# Altium project zulu_a7_hdi_optimized.PrjPcb (part 2 of 2)

## Sheet zulu_a7_4.SchDoc
size 240 x 314 mm; Author: Christian Tambe; VERSION#: 1.0; Origin: Eagle; OriginPath: C:\Users\tambe\Documents\Electronics\Zulu_A7\Zulu_Altrium\zulu_a7.sch; OriginSheet: 5; OriginDescription: FT2232HL, JTAG, CLOCK
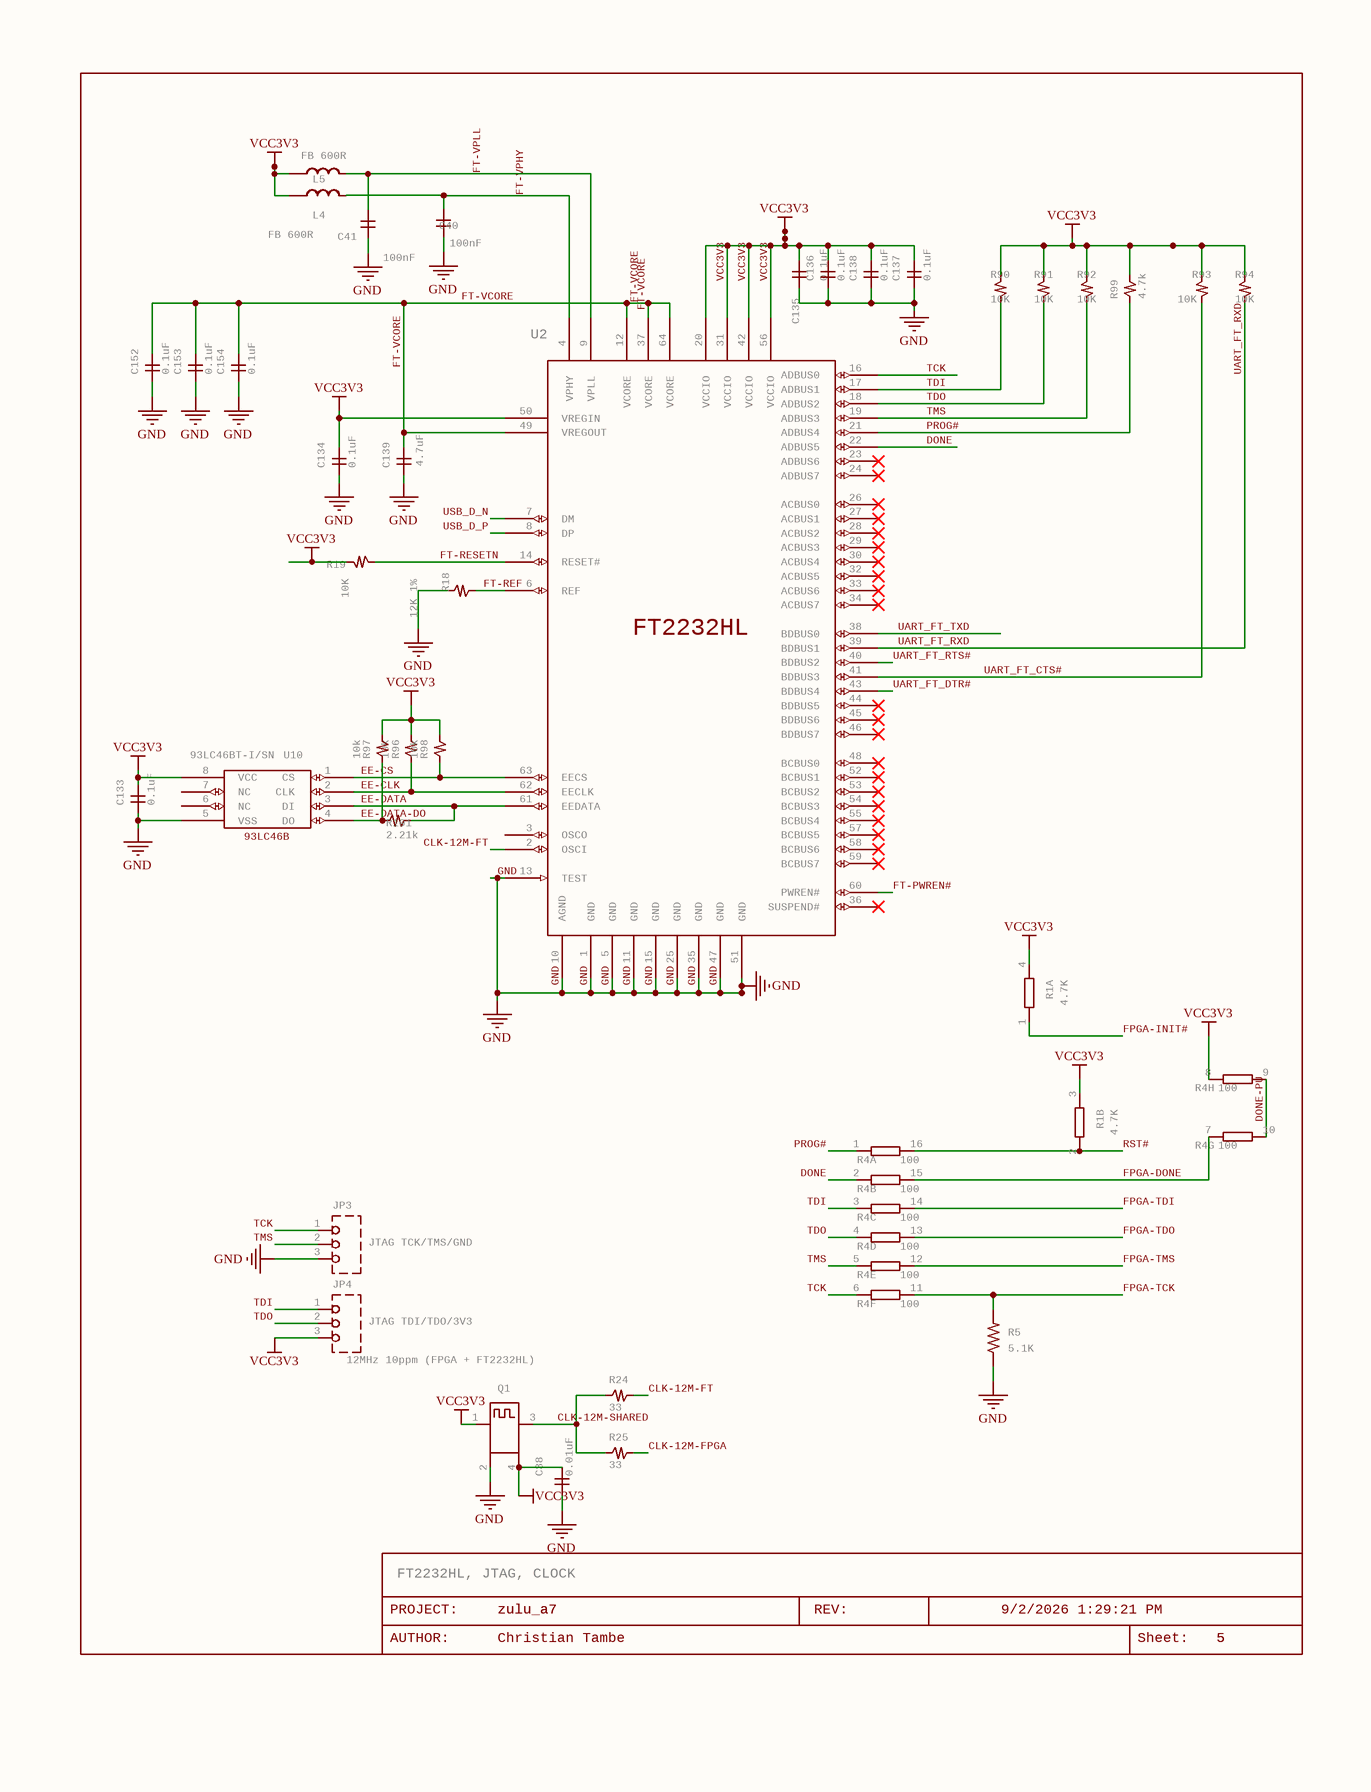
[diagram p4: zulu_a7_4.SchDoc]

### Parts
C38  0.01uF  [C0201]
C40  100nF  [C0201]
C41  100nF  [C0201]
C133  0.1uF  [C0201]
C134  0.1uF  [C0201]
C135  0.1uF  [C0201]
C136  0.1uF  [C0201]
C137  0.1uF  [C0201]
C138  0.1uF  [C0201]
C139  4.7uF  [C0402]
C152  0.1uF  [C0201]
C153  0.1uF  [C0201]
C154  0.1uF  [C0201]
FRAME4  LAST_DATE_TIME: 9/2/2026 1:29:21 PM  Sheet: Sheet:  SHEET: 5  REV: REV:  PROJECT: PROJECT:  DRAWING_NAME: zulu_a7  AUTHOR: Christian Tambe  (hidden comment: DOCFIELD)  (graphical)
JP3  JTAG TCK/TMS/GND  [1X03-NOSILK]
JP4  JTAG TDI/TDO/3V3  [1X03-NOSILK]
L4  FB 600R  [IND0603]
L5  FB 600R  [IND0603]
Q1  12MHz 10ppm (FPGA + FT2232HL)  [32X25]
R1  4.7K  [742C043]  (parts A,B of 2)
R4  100  [742C163]  (parts A,B,C,D,E,F,G,H of 8)
R5  5.1K  [R0201]
R18  12K 1%  [R0402]
R19  10K  [R0201]
R24  33  [R0201]
R25  33  [R0201]
R90  10K  [R0201]
R91  10K  [R0201]
R92  10K  [R0201]
R93  10K  [R0201]
R94  10K  [R0201]
R96  10k  [R0201]
R97  10k  [R0201]
R98  10k  [R0201]
R99  4.7k  [R0201]
R101  2.21k  [R0201]
U2  FT2232HL USB-UART/JTAG Bridge  [FT2232HL-LQFP64]  (value not drawn)
U10  93LC46BT-I/SN  [SPI-8_SOIC_150]

### Nets
GND: C38.1 C40.1 C41.1 C133.1 C134.1 C135.1 C136.1 C137.1 C138.1 C139.1 C152.1 C153.1 C154.1 JP3.3 Q1.2 R5.1 R18.1 U2.1(GND) U2.5(GND) U2.10(AGND) U2.11(GND) U2.13(TEST) U2.15(GND) U2.25(GND) U2.35(GND) U2.47(GND) U2.51(GND) U10.5(VSS)
VCC3V3: C38.2 C133.2 C134.2 C135.2 C136.2 C137.2 C138.2 JP4.3 L4.2 L5.2 Q1.1 Q1.4 R1.3 R1.4 R4.8 R19.2 R90.2 R91.2 R92.2 R93.2 R94.2 R96.2 R97.2 R98.2 R99.2 U2.20(VCCIO) U2.31(VCCIO) U2.42(VCCIO) U2.50(VREGIN) U2.56(VCCIO) U10.8(VCC)
CLK-12M-FPGA: R25.2
CLK-12M-FT: R24.2 U2.2(OSCI)
CLK-12M-SHARED: Q1.3 R24.1 R25.1
DONE: R4.2 U2.22(ADBUS5)
DONE-PU: R4.9 R4.10
EE-CLK: R96.1 U2.62(EECLK) U10.2(CLK)
EE-CS: R98.1 U2.63(EECS) U10.1(CS)
EE-DATA: R101.2 U2.61(EEDATA) U10.3(DI)
EE-DATA-DO: R97.1 R101.1 U10.4(DO)
FPGA-DONE: R4.7 R4.15
FPGA-INIT#: R1.1
FPGA-TCK: R4.11 R5.2
FPGA-TDI: R4.14
FPGA-TDO: R4.13
FPGA-TMS: R4.12
FT-PWREN#: U2.60(PWREN#)
FT-REF: R18.2 U2.6(REF)
FT-RESETN: R19.1 U2.14(RESET#)
FT-VCORE: C139.2 C152.2 C153.2 C154.2 U2.12(VCORE) U2.37(VCORE) U2.49(VREGOUT) U2.64(VCORE)
FT-VPHY: C40.2 L4.1 U2.4(VPHY)
FT-VPLL: C41.2 L5.1 U2.9(VPLL)
PROG#: R4.1 R99.1 U2.21(ADBUS4)
RST#: R1.2 R4.16
TCK: JP3.1 R4.6 U2.16(ADBUS0)
TDI: JP4.1 R4.3 R90.1 U2.17(ADBUS1)
TDO: JP4.2 R4.4 R91.1 U2.18(ADBUS2)
TMS: JP3.2 R4.5 R92.1 U2.19(ADBUS3)
UART_FT_CTS#: R93.1 U2.41(BDBUS3)
UART_FT_DTR#: U2.43(BDBUS4)
UART_FT_RTS#: U2.40(BDBUS2)
UART_FT_RXD: R94.1 U2.39(BDBUS1)
UART_FT_TXD: U2.38(BDBUS0)
USB_D_N: U2.7(DM)
USB_D_P: U2.8(DP)

Not connected (* = marked no-connect by the designer): U2 3(OSCO) 23(ADBUS6)* 24(ADBUS7)* 26(ACBUS0)* 27(ACBUS1)* 28(ACBUS2)* 29(ACBUS3)* 30(ACBUS4)* 32(ACBUS5)* 33(ACBUS6)* 34(ACBUS7)* 36(SUSPEND#)* 44(BDBUS5)* 45(BDBUS6)* 46(BDBUS7)* 48(BCBUS0)* 52(BCBUS1)* 53(BCBUS2)* 54(BCBUS3)* 55(BCBUS4)* 57(BCBUS5)* 58(BCBUS6)* 59(BCBUS7)*; U10 6(NC) 7(NC)

### Notes on the sheet
- (near FRAME4) FT2232HL, JTAG, CLOCK
- (near FRAME4) AUTHOR:

### Library data of the parts
C38 = C-GENERICC0201: CAPACITOR, generic non-polarized, horizontal pins; GateName_1: G$1; SymbolName_1: C-GENERIC-H; MANF: Murata; MANF#: GRM033R71E103KE14D; NOTE: 0402 -> 0201 on U2's support. 50V drops to 25V, which is still far over what a 3.3V rail needs -- the 50V part was over-specified. Confirm the MPN suffix before ordering.; SPEC: X7R 25V +-10%, 0.30 mm max; DeviceName: C0201; LibraryName: rcl; DeviceSetName: C-GENERIC
C40 C41 C133-C138 = C-GENERICC0201: CAPACITOR, generic non-polarized, horizontal pins; GateName_1: G$1; SymbolName_1: C-GENERIC-H; MANF: Murata; MANF#: GRM033R61A104KE15D; NOTE: 0402 -> 0201 on U2's support. The DIELECTRIC AND VOLTAGE BOTH CHANGE: X7R 16V becomes X5R 10V, because 0201 at this capacitance is an X5R part. X5R narrows the temperature range to -55..+85 C from X7R's +125, which suits this board but is not a like-for-like swap. At 0.1 uF the DC bias derating is mild, unlike the 0.47 uF on sheet 7. Confirm the MPN suffix against Murata's data before ordering.; SPEC: X5R 10V +-10%, 0.30 mm max; DeviceName: C0201; LibraryName: rcl; DeviceSetName: C-GENERIC
C139 = C-GENERICC0402: CAPACITOR, generic non-polarized, horizontal pins; GateName_1: G$1; SymbolName_1: C-GENERIC-H; MANF: Taiyo Yuden; MANF#: MSASJ105BB5475MFNA01; SPEC: X5R 6.3V +-20% 0402 4.7uF, 0.65 mm max, about 3.7 uF left at 1.8 V; Digi-Key alias JMK105BBJ475MV-F (587-2787-1-ND, 1.6 M pcs); replaced the unobtainable 3.3 uF GRM155R60J335ME15D on the FT2232H VCORE node (FTDI minimum 3.3 uF) on 2026-09-08; DeviceName: C0402; LibraryName: rcl; DeviceSetName: C-GENERIC
C152-C154 = C-GENERICC0201: CAPACITOR, generic non-polarized, horizontal pins; GateName_1: G$1; SymbolName_1: C-GENERIC-H; MANF: Murata; MANF#: GRM033R61A104KE15D; NOTE: FT2232H core-rail decoupling. DS_FT2232H Figures 4.1 and 6.1 show a 100 nF at each VCORE pin besides the 4.7 uF bulk (C39, C139); the board had the bulk and none of these. Same part as the eight 0.1 uF and 100 nF 0201 capacitors already on this sheet, so no new BOM line. AT LAYOUT: put one beside each of pins 12, 37 and 64 with the shortest ground return you can manage -- that placement is the whole point of them.; SPEC: X5R 10V +-10% 0201 0.1uF, 0.30 mm max -- one per FT2232H VCORE pin, added 2026-09-09 after docs/connectivity_check.md found the core rail carrying bulk only; DeviceName: C0201; LibraryName: rcl; DeviceSetName: C-GENERIC
FRAME4 = DOCFIELD: DOCUMENT FIELD; GateName_1: G$1; SymbolName_1: DOCFIELD; LibraryName: ctambe; DeviceSetName: DOCFIELD
JP3 = TESTPT-1X3NOSILK: Three plated holes, 1x3 on 2.54 mm   NOT a fitted header, which is why it is no longer called one. The footprint is an ordinary 1x3 header pattern and a strip could be soldered in for bring-up, but nothing is populated: a 1x3 body clears the Pmod shroud beside it by 0.09 mm, inside anyone's assembly tolerance. Drawn dashed with open holes so the sheet stops reading as a connector, the way the 2x3 it replaced did.; SymbolName_1: TP1X3; DeviceName: NOSILK; NOTE: Bare plated holes -- NO HEADER FITTED, nothing to order. Three of the six JTAG holes; JP4 carries the other three, 17.96 mm away on the far side of the Pmod. Each row has 3.05 mm of board to the Pmod but only 0.09 mm to a 1x3 strip's body, so these are for flying leads or a pogo jig. The FT2232 does JTAG over USB on channel B; this is the fallback.; DNS: Yes; SPEC: DNS - do not stuff: three bare plated holes, 1x3 on 2.54 mm, for flying leads or pogo pins; no part to order (flagged 2026-09-08); GateName_1: A; LibraryName: pinhead; DeviceSetName: TESTPT-1X3
JP4 = TESTPT-1X3NOSILK: Three plated holes, 1x3 on 2.54 mm   NOT a fitted header, which is why it is no longer called one. The footprint is an ordinary 1x3 header pattern and a strip could be soldered in for bring-up, but nothing is populated: a 1x3 body clears the Pmod shroud beside it by 0.09 mm, inside anyone's assembly tolerance. Drawn dashed with open holes so the sheet stops reading as a connector, the way the 2x3 it replaced did.; SymbolName_1: TP1X3; DeviceName: NOSILK; NOTE: Bare plated holes -- NO HEADER FITTED, nothing to order. Three of the six JTAG holes; JP3 carries the other three, 17.96 mm away on the far side of the Pmod. Each row has 3.05 mm of board to the Pmod but only 0.09 mm to a 1x3 strip's body, so these are for flying leads or a pogo jig. The FT2232 does JTAG over USB on channel B; this is the fallback.; DNS: Yes; SPEC: DNS - do not stuff: three bare plated holes, 1x3 on 2.54 mm, for flying leads or pogo pins; no part to order (flagged 2026-09-08); GateName_1: A; LibraryName: pinhead; DeviceSetName: TESTPT-1X3
L4 L5 = INDUCTOR: INDUCTOR, generic power inductor; GateName_1: G$1; MANF: Murata; MANF#: BLM18KG601SN1D; SPEC: ferrite bead 600 ohm at 100 MHz +-25%, 1.3 A at 85 C, 0.15 ohm max, 0603, 0.90 mm max; replaced BLM18PG601SN1D (a number Murata never made; the spec 600 ohm/1.5 A is BLM18SP601SN1D) on 2026-09-08; L4/L5 feed the FT2232H VPHY/VPLL (60 mA max), L6 GNDADC, L7 VCCADC (25 mA); SymbolName_1: INDUCTOR; LibraryName: ctambe; DeviceSetName: INDUCTOR
Q1 = OSC_CHIPASEM1-12MHZ: Crystal Chip; GateName_1: G$1; DeviceName: ECS-3225SMV; MANF: ECS; MANF#: ECS-3225SMV-120-FP-TR; NOTE: ACTIVE OSCILLATOR, NOT A CRYSTAL -- the schematic settles it: pin 2 to GND, pin 4 to VCC3V3, pin 3 out into R24 and R25, and pin 1 tied to VCC3V3, which is a 4-pad XO with its enable held high. A crystal would have two pads and load capacitors. THE FREQUENCY IS NOT A CHOICE: the FT2232H wants 12 MHz for its USB PLL, so that was fixed before anything else. 25 ppm is the value already recorded and is comfortably inside what FTDI asks of the reference. Output drives two loads through 33R each, the FT2232's OSCI and the FPGA clock ball. Pin 1 to Vdd suits either an OE part or one with pin 1 not connected, so the choice is not narrowed by it. ASEM1 is the family the design note already named. Confirm the suffix -- it encodes stability and temperature range and is the easy thing to get wrong.; SPEC: 12.000 MHz HCMOS XO, 1.62-3.63 V, +-10 ppm incl. initial, temp -40..105 C, supply, load, reflow and aging (ECS-3225SMV sheet p1), 3.2x2.5x1.2 mm, pin 1 tri-state (H/NC = run), 6 mA typ / 10 mA max; replaced the +-50 ppm ASEM1-12.000MHZ-LC-T on 2026-09-08; SymbolName_1: OSC_CHIP; LibraryName: ctambe; DeviceSetName: OSC_CHIP
R1 = RES2742: Resistor 2-pack   Package of two resistors.; GateName_1: A; SymbolName_1: R1NV0; GateName_2: B; DeviceName: 742; DeviceSetName: RES2; MANF: CTS; MANF#: 742C043472JP; SPEC: 2 x 4.7K +-5% isolated array, 0606 concave 1.60 x 1.60 mm, 0.80 mm pitch, 63 mW per element; NOTE: The two configuration pull-ups in one package: A on INIT_B (net FPGA-INIT#), B on PROGRAM_B (net RST#). Both commons are pads 3 and 4, side by side on one long side of the body, and both go to VCC3V3. CTS publishes ONE recommended land pattern for the whole 742 package family, so this footprint is the 742C083 pad cell already validated for R34 with two pads per side instead of four. 5 percent: the 742C043 has no 1 percent option either, and a configuration pull-up does not care; 63 mW per element against the 2.3 mW that 3.3 V across 4.7 k actually dissipates. Alternate on the identical land: Panasonic EXB-V4V472JV, same 1.60 x 1.60 mm concave body on 0.80 mm pitch. Do NOT substitute EXB-34V472JV -- same size, convex terminals, different land. R99, the third 4.7 k pull-up on this sheet, stays discrete: it sits on PROG#, the far side of the 100 ohm now in R4. TOLERANCE AGAINST UG470: Table 2-4 asks for a pull-up of 4.7 kohm OR LESS on both of these pins, and this is a 5 percent part, so its worst case is 4.935 k -- 5 percent outside the stated maximum. That is a wording problem rather than a physical one. The limit exists to hold the pin high against input leakage, and DS181 worst-case leakage of 15 uA across 4.935 k is 74 mV, against a VIH of 2.0 V. The discretes this replaces were 1 percent parts and were already outside the same limit, at 4.747 k. Strict compliance would mean 4.3 kohm +-5 percent (4.515 k worst case), but CTS does not stock a 432 code in the 742C043 family -- the stocked spread is 101, 220, 470, 471, 472, 473, 102, 103 and 104 -- so buying compliance here would cost availability, which is the thing that actually stops a board getting built. Dropping to the next stocked value, 1 k, would cost margin where it matters: it lifts the low level the bridge can assert on RST# through the 100 ohm from 0.10 V to 0.43 V.; SymbolName_2: R1NV0; LibraryName: ctambe
R4 = RES8742: Resistor 8-pack   Package of eight resistors, six used.; GateName_1: A; SymbolName_1: R1NV0; GateName_2: B; GateName_3: C; GateName_4: D; GateName_5: E; GateName_6: F; GateName_7: G; GateName_8: H; DeviceName: 742; DeviceSetName: RES8; MANF: CTS; MANF#: 742C163101JP; SPEC: 8 x 100 ohm +-5% isolated array, 2506 concave 6.40 x 1.60 mm, 0.80 mm pitch, 63 mW per element; six elements used, two spare; NOTE: The six 100 ohm series resistors between the FT2232H and the FPGA in one package: A PROG#, B DONE, C TDI, D TDO, E TMS, F TCK, in the order they are drawn down the sheet. Pads 1-6 face the bridge and pads 16-11 face the FPGA, one long side of the body per end of the link. TWO ELEMENTS ARE SPARE (pads 7-10); they sit at the far end of the body, so the six used run contiguously from pad 1. Leave the spare pads unconnected. There is no purchasable 6-element part: CTS 753123101GP is a genuine 12-terminal, 6-isolated-element, 100 ohm array, but Digi-Key holds none, quotes 28 weeks at MOQ 1000 and $2.63 each, and its 12-SRT body is 8.76 x 2.03 mm, LARGER than this 8-element chip array. Same CTS 74x concave family as R34, so all three arrays on the board answer to one CTS land-pattern rule (0.45 x 0.80 mm pads, 0.80 mm pitch, 2.60 mm across). 5 percent like R34: the 742C163 has no 1 percent option, which series damping does not care about, and 63 mW per element is twenty times the worst case. Alternate if the layout needs the length back: Panasonic EXB-2HV101JV is the same 8 x 100 ohm isolated in 3.80 x 1.60 mm, but convex terminals on 0.50 mm pitch, so it needs its own land pattern. AT LAYOUT: all six lines now converge on one part -- put it between the bridge and the FPGA where the four JTAG lines already run together, and keep TCK, element F on pads 6/11, at the end of the body: its only live neighbour is TMS. SUPPLY CAVEATS, all read 2026-09-09. (1) CTS files the whole 74x series -- this part and R34's 742C083 with it -- under Legacy Products on its own site. Near-term risk is low: 25,352 stocked, MOQ 1, deep sibling stock. It is not a young family. (2) There is no drop-in second source on this land. The alternate above needs its own footprint, so this one package is a single point of failure where the six discretes it replaces had many interchangeable vendors; if that matters for the build, qualify a second 16-pad 0.80 mm concave array on the same land first. (3) Every stock and price figure here is Digi-Key alone -- Mouser, Arrow, TTI, Octopart and LCSC all refused automated reads that day -- so none of it has second-distributor corroboration. AND ONE LAYOUT POINT: the two spare elements are unplaced, so pads 7-10 carry no net. If the layout wants them as grounded metal beside TCK, that has to come back here as two more placed gates with both ends on GND; it cannot be done in the PCB alone.; SymbolName_2: R1NV0; SymbolName_3: R1NV0; SymbolName_4: R1NV0; SymbolName_5: R1NV0; SymbolName_6: R1NV0; SymbolName_7: R1NV0; SymbolName_8: R1NV0; LibraryName: ctambe
R5 = R-US_R0201: RESISTOR, American symbol; GateName_1: G$1; SymbolName_1: R-US; DeviceSetName: R-US_; MANF: Yageo; MANF#: RC0201FR-075K1L; SPEC: thick film +-1%, 1/20W, 0201; DeviceName: R0201; LibraryName: rcl; MOUSER#: 301-5.1K-RC
R18 = R-US_SMALLR0402: RESISTOR, American symbol, small 2-zigzag variant (sheet 2 only); GateName_1: G$1; MANF: Yageo; MANF#: RC0402FR-0712KL; NOTE: Stays 0402 deliberately. Power is trivial (0.9 mW) and 1 percent is 1 percent at any size, but this is the FT2232's RREF -- it sets the USB transceiver bias current. There is no space pressure on this board any more, so there is nothing to gain against a part whose drift shows up as USB signal quality.; SPEC: thick film +-1%, 1/16W, 0402; SymbolName_1: R-US_SMALL; DeviceName: R0402; LibraryName: rcl; DeviceSetName: R-US_SMALL
R19 R90-R94 R96-R98 = R-US_SMALLR0201: RESISTOR, American symbol, small 2-zigzag variant (sheet 2 only); GateName_1: G$1; MANF: Yageo; MANF#: RC0201FR-0710KL; SPEC: thick film +-1%, 1/20W, 0201; SymbolName_1: R-US_SMALL; DeviceName: R0201; LibraryName: rcl; DeviceSetName: R-US_SMALL
R24 R25 = R-US_SMALLR0201: RESISTOR, American symbol, small 2-zigzag variant (sheet 2 only); GateName_1: G$1; MANF: Yageo; MANF#: RC0201FR-0733RL; SPEC: thick film +-1%, 1/20W, 0201; SymbolName_1: R-US_SMALL; DeviceName: R0201; LibraryName: rcl; DeviceSetName: R-US_SMALL
R99 = R-US_SMALLR0201: RESISTOR, American symbol, small 2-zigzag variant (sheet 2 only); GateName_1: G$1; MANF: Yageo; MANF#: RC0201FR-074K7L; SPEC: thick film +-1%, 1/20W, 0201; SymbolName_1: R-US_SMALL; DeviceName: R0201; LibraryName: rcl; DeviceSetName: R-US_SMALL
R101 = R-US_SMALLR0201: RESISTOR, American symbol, small 2-zigzag variant (sheet 2 only); GateName_1: G$1; MANF: Yageo; MANF#: RC0201FR-072K21L; SPEC: thick film +-1%, 1/20W, 0201; SymbolName_1: R-US_SMALL; DeviceName: R0201; LibraryName: rcl; DeviceSetName: R-US_SMALL
U2 = FT2232HQ-QFN64: FTDI FT2232HL Dual USB-UART/MPSSE Bridge, LQFP-64. Channel A = MPSSE JTAG to the FPGA (ADBUS0-3 = TCK/TDI/TDO/TMS, ADBUS4/5 = PROG#/DONE). Channel B = UART (BDBUS0-4 = TXD/RXD/RTS#/CTS#/DTR#). Same pin numbering as the FT2232HQ, no exposed pad. Replaced the FT2232HQ on 2026-09-09.; GateName_1: G$1; SymbolName_1: FT2232HQ-BOX; DeviceName: -LQFP64; MANF#: FT2232HL-REEL; SPEC: USB 2.0 Hi-Speed dual-channel UART/FIFO/MPSSE bridge, LQFP-64 10 x 10 mm body, 12 x 12 mm over leads, 0.5 mm pitch, JEDEC MS-026 BCD, no exposed pad; same die and pin numbering as the FT2232HQ (DS_FT2232H v2.10 section 3.1); channel A MPSSE JTAG + PROG#/DONE, channel B UART; 12 MHz CMOS oscillator into OSCI, internal 1.8 V regulator, 93LC46B EEPROM, REF 12 k; replaced the FT2232HQ (0 stock until April 2027) on 2026-09-09; NOTE: FT2232HL-REEL: Digi-Key 0 with 1,000 expected 19-Feb-2027 ($5.30, 50-week lead); LCSC C27882 4,767 in stock at $11.45 (not an FTDI-authorized channel: name it explicitly or consign for a PCBWay build). Pin numbers unchanged from the FT2232HQ; the QFN exposed pad (pin EP, GND) has no LQFP counterpart, so that pin and its ground stub were removed. thetaJA 37.66 C/W for the LQFP vs 29.67 for the QFN (DS_FT2232H Table 5.7). Footprint FT2232HL-LQFP64 to be drawn from Figure 8.2 or FTDI TN_166. Alternates on the same pin numbers: FT2232HQ (QFN-64) and FT4232HL / FT4232HQ (UART lands on channel C, EEPROM re-templated, PID 0x6011); the FT2232H-56Q keeps every signal but renumbers every pin.; LibraryName: ctambe; DeviceSetName: FT2232HL; FT2232HL: FT2232HL; MANF: FTDI
U10 = EEPROM-93LC46B-I/SN: Microchip 93LC46BT-I/SN, FTDI EEPROM (USB VID/PID/descriptors)   64 x 16 = 1 Kbit. DS_FT2232H p27: "The EEPROM should be a 16 bit wide configuration such as a Microchip 93LC46B or equivalent capable of a 1 Mbit/s clock rate at VCC = +3.00 V to 3.6 V." The B suffix is the fixed x16 organisation, so pins 6 and 7 are both no-connect; only the selectable C variant puts ORG on pin 6.; GateName_1: G$1; SymbolName_1: EEPROM-93LC46B-BOX; DeviceName: -I/SN; LibraryName: ctambe; DeviceSetName: EEPROM-93LC46B; 93LC46B: 93LC46B; MANF: Microchip; MANF#: 93LC46BT-I/SN

## Sheet zulu_a7_6.SchDoc
size 241 x 313 mm; Author: Christian Tambe; VERSION#: 1.0; Origin: Eagle; OriginPath: C:\Users\tambe\Documents\Electronics\Zulu_A7\Zulu_Altrium\zulu_a7.sch; OriginSheet: 7; OriginDescription: FPGA POWER
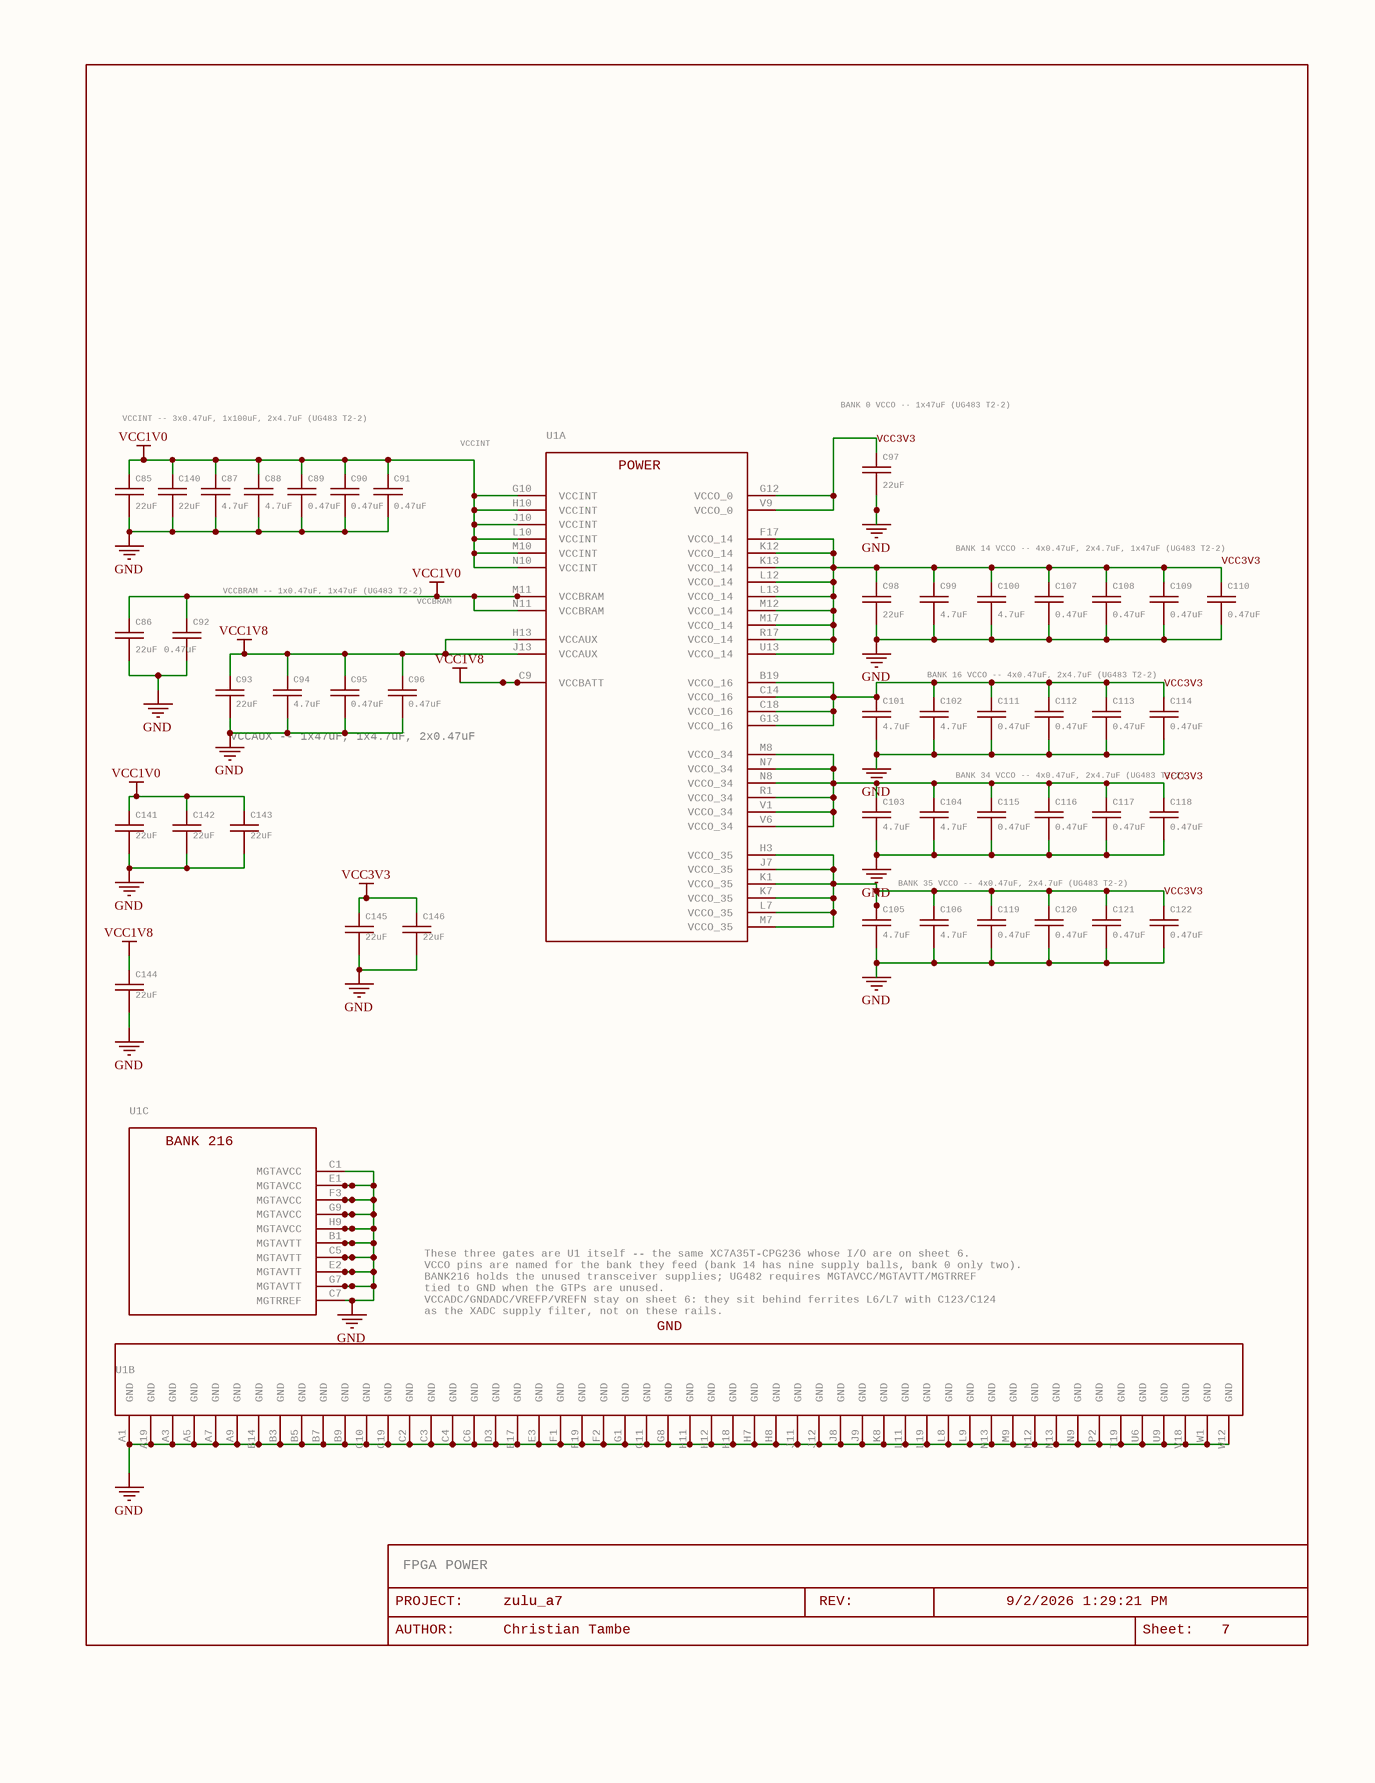
[diagram p5: zulu_a7_6.SchDoc]

### Parts
C85  22uF  [C0805]
C86  22uF  [C0805]
C87  4.7uF  [C0603]
C88  4.7uF  [C0603]
C89  0.47uF  [C0201]
C90  0.47uF  [C0201]
C91  0.47uF  [C0201]
C92  0.47uF  [C0201]
C93  22uF  [C0805]
C94  4.7uF  [C0603]
C95  0.47uF  [C0201]
C96  0.47uF  [C0201]
C97  22uF  [C0805]
C98  22uF  [C0805]
C99  4.7uF  [C0603]
C100  4.7uF  [C0603]
C101  4.7uF  [C0603]
C102  4.7uF  [C0603]
C103  4.7uF  [C0603]
C104  4.7uF  [C0603]
C105  4.7uF  [C0603]
C106  4.7uF  [C0603]
C107  0.47uF  [C0201]
C108  0.47uF  [C0201]
C109  0.47uF  [C0201]
C110  0.47uF  [C0201]
C111  0.47uF  [C0201]
C112  0.47uF  [C0201]
C113  0.47uF  [C0201]
C114  0.47uF  [C0201]
C115  0.47uF  [C0201]
C116  0.47uF  [C0201]
C117  0.47uF  [C0201]
C118  0.47uF  [C0201]
C119  0.47uF  [C0201]
C120  0.47uF  [C0201]
C121  0.47uF  [C0201]
C122  0.47uF  [C0201]
C140  22uF  [C0805]
C141  22uF  [C0805]
C142  22uF  [C0805]
C143  22uF  [C0805]
C144  22uF  [C0805]
C145  22uF  [C0805]
C146  22uF  [C0805]
FRAME6  LAST_DATE_TIME: 9/2/2026 1:29:21 PM  Sheet: Sheet:  SHEET: 7  REV: REV:  PROJECT: PROJECT:  DRAWING_NAME: zulu_a7  AUTHOR: Christian Tambe  (hidden comment: DOCFIELD)  (graphical)
U1  XC7A35T-1CPG236C  [XC7A35T-CPG236]  (value not drawn)  (parts A,B,C of 142)

### Nets
GND: C85.2 C86.2 C87.2 C88.2 C89.2 C90.2 C91.2 C92.2 C93.2 C94.2 C95.2 C96.2 C97.2 C98.2 C99.2 C100.2 C101.2 C102.2 C103.2 C104.2 C105.2 C106.2 C107.2 C108.2 C109.2 C110.2 C111.2 C112.2 C113.2 C114.2 C115.2 C116.2 C117.2 C118.2 C119.2 C120.2 C121.2 C122.2 C140.2 C141.2 C142.2 C143.2 C144.2 C145.2 C146.2 U1.A1(GND) U1.A3(GND) U1.A5(GND) U1.A7(GND) U1.A9(GND) U1.A19(GND) U1.B1(MGTAVTT) U1.B3(GND) U1.B5(GND) U1.B7(GND) U1.B9(GND) U1.B14(GND) U1.C1(MGTAVCC) U1.C2(GND) U1.C3(GND) U1.C4(GND) U1.C5(MGTAVTT) U1.C6(GND) U1.C7(MGTRREF) U1.C10(GND) U1.C19(GND) U1.D3(GND) U1.E1(MGTAVCC) U1.E2(MGTAVTT) U1.E3(GND) U1.E17(GND) U1.F1(GND) U1.F2(GND) U1.F3(MGTAVCC) U1.F19(GND) U1.G1(GND) U1.G7(MGTAVTT) U1.G8(GND) U1.G9(MGTAVCC) U1.G11(GND) U1.H7(GND) U1.H8(GND) U1.H9(MGTAVCC) U1.H11(GND) U1.H12(GND) U1.H18(GND) U1.J8(GND) U1.J9(GND) U1.J11(GND) U1.J12(GND) U1.K8(GND) U1.L8(GND) U1.L9(GND) U1.L11(GND) U1.L19(GND) U1.M9(GND) U1.M13(GND) U1.N9(GND) U1.N12(GND) U1.N13(GND) U1.P2(GND) U1.T19(GND) U1.U6(GND) U1.U9(GND) U1.V18(GND) U1.W1(GND) U1.W12(GND)
VCC1V0: C85.1 C86.1 C87.1 C88.1 C89.1 C90.1 C91.1 C92.1 C140.1 C141.1 C142.1 C143.1 U1.G10(VCCINT) U1.H10(VCCINT) U1.J10(VCCINT) U1.L10(VCCINT) U1.M10(VCCINT) U1.M11(VCCBRAM) U1.N10(VCCINT) U1.N11(VCCBRAM)
VCC1V8: C93.1 C94.1 C95.1 C96.1 C144.1 U1.C9(VCCBATT) U1.H13(VCCAUX) U1.J13(VCCAUX)
VCC3V3: C97.1 C98.1 C99.1 C100.1 C101.1 C102.1 C103.1 C104.1 C105.1 C106.1 C107.1 C108.1 C109.1 C110.1 C111.1 C112.1 C113.1 C114.1 C115.1 C116.1 C117.1 C118.1 C119.1 C120.1 C121.1 C122.1 C145.1 C146.1 U1.B19(VCCO_16) U1.C14(VCCO_16) U1.C18(VCCO_16) U1.F17(VCCO_14) U1.G12(VCCO_0) U1.G13(VCCO_16) U1.H3(VCCO_35) U1.J7(VCCO_35) U1.K1(VCCO_35) U1.K7(VCCO_35) U1.K12(VCCO_14) U1.K13(VCCO_14) U1.L7(VCCO_35) U1.L12(VCCO_14) U1.L13(VCCO_14) U1.M7(VCCO_35) U1.M8(VCCO_34) U1.M12(VCCO_14) U1.M17(VCCO_14) U1.N7(VCCO_34) U1.N8(VCCO_34) U1.R1(VCCO_34) U1.R17(VCCO_14) U1.U13(VCCO_14) U1.V1(VCCO_34) U1.V6(VCCO_34) U1.V9(VCCO_0)

### Notes on the sheet
- VCCINT -- 3x0.47uF, 1x100uF, 2x4.7uF (UG483 T2-2)
- (near C97) BANK 0 VCCO -- 1x47uF (UG483 T2-2)
- VCCINT
- BANK 14 VCCO -- 4x0.47uF, 2x4.7uF, 1x47uF (UG483 T2-2)
- (near C92) VCCBRAM -- 1x0.47uF, 1x47uF (UG483 T2-2)
- VCCBRAM
- BANK 16 VCCO -- 4x0.47uF, 2x4.7uF (UG483 T2-2)
- VCCAUX -- 1x47uF, 1x4.7uF, 2x0.47uF
- BANK 34 VCCO -- 4x0.47uF, 2x4.7uF (UG483 T2-2)
- BANK 35 VCCO -- 4x0.47uF, 2x4.7uF (UG483 T2-2)
- These three gates are U1 itself -- the same XC7A35T-CPG236 whose I/O are on sheet 6.
  VCCO pins are named for the bank they feed (bank 14 has nine supply balls, bank 0 only two).
  BANK216 holds the unused transceiver supplies; UG482 requires MGTAVCC/MGTAVTT/MGTRREF
  tied to GND when the GTPs are unused.
  VCCADC/GNDADC/VREFP/VREFN stay on sheet 6: they sit behind ferrites L6/L7 with C123/C124
  as the XADC supply filter, not on these rails.
- (near FRAME6) FPGA POWER
- (near FRAME6) AUTHOR:

### Library data of the parts
C85 C86 C93 C97 C98 C140 = C-USC0805: CAPACITOR, American symbol; GateName_1: G$1; SymbolName_1: C-US; MANF: Murata; MANF#: GRM21BR61A226ME44L; SPEC: X5R 10V +-20%, 1.45 mm max; DeviceName: C0805; LibraryName: rcl; DeviceSetName: C-US
C87 C88 C94 C99-C106 = C-USC0603: CAPACITOR, American symbol; GateName_1: G$1; SymbolName_1: C-US; MANF: Murata; MANF#: GRM188R61C475KE11D; SPEC: X5R 16V +-10% 0603 4.7uF, 0.95 mm max; 10 V grades (KE15D obsolete, KAAJD NRND) replaced by the 16 V one on 2026-09-08; DeviceName: C0603; LibraryName: rcl; DeviceSetName: C-US
C89-C92 C95 C96 C107-C122 = C-USC0201: CAPACITOR, American symbol; GateName_1: G$1; SymbolName_1: C-US; MANF: Murata; MANF#: GRM033R60J474KE90D; NOTE: 0402 -> 0201 to cut ESL, following Cmod A7. THE VOLTAGE RATING DROPS 16V to 6.3V and that costs real capacitance: on VCC3V3 a 6.3V 0201 sits at 52 percent of rating and DC bias typically removes 60-75 percent of it, against 15-25 percent for the 16V 0402 it replaces. The BOM value is unchanged, so validate.py's UG483 count still passes -- it counts nominal values and cannot see bias derating. Effective decoupling on 3V3 is roughly half what it was. Confirm the MPN suffix and the bias curve against Murata's data before ordering.; SPEC: X5R 6.3V +-10% 0201 0.47uF; KE15D was a typo, KE90D is the live number; DeviceName: C0201; LibraryName: rcl; DeviceSetName: C-US
C141-C146 = C-USC0805: CAPACITOR, American symbol; GateName_1: G$1; SymbolName_1: C-US; MANF: Murata; MANF#: GRM21BR61A226ME44L; NOTE: Second half of a bulk position: each 47uF 1206 became two 22uF 0805. Nominal drops 47 -> 44 uF per position, but the 0805 is 10V where the 1206 was 6.3V, so it derates less under bias and the pair should deliver at least what the single part did. Height also drops 1.60 -> 1.45 mm max, which the back-side budget against the 2.54 mm header standoff cares about.; SPEC: X5R 10V +-20%, 1.45 mm max; DeviceName: C0805; LibraryName: rcl; DeviceSetName: C-US
FRAME6 = DOCFIELD: DOCUMENT FIELD; GateName_1: G$1; SymbolName_1: DOCFIELD; LibraryName: ctambe; DeviceSetName: DOCFIELD
U1 = XC7A35T-CPG236-1CPG236C: Xilinx Artix-7 XC7A35T-1CPG236C   Replacement for the Spartan-6 XC6SLX25-FT256. See design notes: SDRAM/microSD/GPIO ball assignments verified against Digilent Cmod A7-35T (same device+package); config/JTAG/power ball assignments are functionally correct placeholders pending verification against the official Xilinx pinout file.; GateName_1: PWR; SymbolName_1: A7_PWR; GateName_2: GND; SymbolName_2: A7_GND; GateName_3: BANK216; SymbolName_3: A7_BANK216; GateName_4: PART_VALUE; SymbolName_4: PV_GATE; GateName_5: SDRAM_A0; SymbolName_5: PIN_GATE_IO; GateName_6: SDRAM_A1; GateName_7: SDRAM_A2; GateName_8: SDRAM_A3; GateName_9: SDRAM_A4; GateName_10: SDRAM_A5; GateName_11: SDRAM_A6; GateName_12: SDRAM_A7; GateName_13: SDRAM_A8; GateName_14: SDRAM_A9; GateName_15: SDRAM_A10; GateName_16: SDRAM_A11; GateName_17: SDRAM_A12; GateName_18: SDRAM_BA0; GateName_19: SDRAM_BA1; GateName_20: SDRAM_CAS#; GateName_21: SDRAM_RAS#; GateName_22: SDRAM_WE#; GateName_23: SDRAM_CS#; GateName_24: SDRAM_CKE; GateName_25: SDRAM_CLK; GateName_26: SDRAM_LDQM; GateName_27: SDRAM_UDQM; GateName_28: SDRAM_DQ0; GateName_29: SDRAM_DQ1; GateName_30: SDRAM_DQ2; GateName_31: SDRAM_DQ3; GateName_32: SDRAM_DQ4; GateName_33: SDRAM_DQ5; GateName_34: SDRAM_DQ6; GateName_35: SDRAM_DQ7; GateName_36: SDRAM_DQ8; GateName_37: SDRAM_DQ9; GateName_38: SDRAM_DQ10; GateName_39: SDRAM_DQ11; GateName_40: SDRAM_DQ12; GateName_41: SDRAM_DQ13; GateName_42: SDRAM_DQ14; GateName_43: SDRAM_DQ15; GateName_44: SPI_SPI_CCLK; GateName_45: SPI_D00_MOSI; GateName_46: SPI_D01_DIN; GateName_47: SPI_FCS_B; GateName_48: SD_DAT3; GateName_49: SD_DAT2; GateName_50: SD_DAT1; GateName_51: CHAN0; GateName_52: CHAN1; GateName_53: CHAN2; GateName_54: CHAN3; GateName_55: CHAN4; GateName_56: CHAN5; GateName_57: CHAN6; GateName_58: CHAN7; GateName_59: CHAN8; GateName_60: CHAN9; GateName_61: CHAN10; GateName_62: CHAN11; GateName_63: IO_W7; GateName_64: CHAN12; GateName_65: CHAN13; GateName_66: CHAN14; GateName_67: CHAN15; GateName_68: CHAN16; GateName_69: CHAN17; GateName_70: CHAN18; GateName_71: CHAN19; GateName_72: CHAN20; GateName_73: CHAN21; GateName_74: CHAN22; GateName_75: CHAN23; GateName_76: CHAN24; GateName_77: CHAN25; GateName_78: CHAN26; GateName_79: CHAN27; GateName_80: UART_CTS; SymbolName_80: PIN_GATE_OUT; GateName_81: CHAN-CLK; GateName_82: XADC_P; SymbolName_82: PIN_GATE_IN; GateName_83: USB_PWREN; GateName_84: XADC_N; GateName_85: CLK12M; GateName_86: UART_TXD; GateName_87: UART_RXD; GateName_88: PROGRAM_B; GateName_89: INIT_B; GateName_90: DONE; GateName_91: TCK; GateName_92: TMS; GateName_93: TDI; GateName_94: TDO; GateName_95: M0; GateName_96: M1; GateName_97: M2; GateName_98: CFGBVS; GateName_99: PUDC_B; GateName_100: MGTPRXP0; GateName_101: MGTPRXN0; GateName_102: MGTPRXP1; GateName_103: MGTPRXN1; GateName_104: GNDADC; GateName_105: VCCADC; GateName_106: VP; GateName_107: VN; GateName_108: VREFP; GateName_109: VREFN; GateName_110: DXP; GateName_111: DXN; GateName_112: MGTPTXP0; GateName_113: MGTPTXN0; GateName_114: MGTPTXP1; GateName_115: MGTREFCLK0P; GateName_116: MGTREFCLK0N; GateName_117: MGTREFCLK1P; GateName_118: MGTREFCLK1N; GateName_119: MGTPTXN1; GateName_120: CHAN28; GateName_121: LED2; GateName_122: LED0_R; GateName_123: IO_A14; GateName_124: IO_A15; GateName_125: IO_A16; GateName_126: LED1; GateName_127: BTN; GateName_128: SD_DAT0; GateName_129: LED0_G; GateName_130: IO_W19; GateName_131: LED0_B; GateName_132: IO_C15; GateName_133: IO_B15; GateName_134: SD_CLK; GateName_135: UART_RTS; GateName_136: IO_N2; GateName_137: SD_CMD; GateName_138: UART_DTR; GateName_139: SPI_D03; GateName_140: SPI_D02; GateName_141: XADC1_P; GateName_142: XADC1_N; MANF: AMD/Xilinx; SymbolName_6: PIN_GATE_IO; SymbolName_7: PIN_GATE_IO; SymbolName_8: PIN_GATE_IO; SymbolName_9: PIN_GATE_IO; SymbolName_10: PIN_GATE_IO; SymbolName_11: PIN_GATE_IO; SymbolName_12: PIN_GATE_IO; SymbolName_13: PIN_GATE_IO; SymbolName_14: PIN_GATE_IO; SymbolName_15: PIN_GATE_IO; SymbolName_16: PIN_GATE_IO; SymbolName_17: PIN_GATE_IO; SymbolName_18: PIN_GATE_IO; SymbolName_19: PIN_GATE_IO; SymbolName_20: PIN_GATE_IO; SymbolName_21: PIN_GATE_IO; SymbolName_22: PIN_GATE_IO; SymbolName_23: PIN_GATE_IO; SymbolName_24: PIN_GATE_IO; SymbolName_25: PIN_GATE_IO; SymbolName_26: PIN_GATE_IO; SymbolName_27: PIN_GATE_IO; SymbolName_28: PIN_GATE_IO; SymbolName_29: PIN_GATE_IO; SymbolName_30: PIN_GATE_IO; SymbolName_31: PIN_GATE_IO; SymbolName_32: PIN_GATE_IO; SymbolName_33: PIN_GATE_IO; SymbolName_34: PIN_GATE_IO; SymbolName_35: PIN_GATE_IO; SymbolName_36: PIN_GATE_IO; SymbolName_37: PIN_GATE_IO; SymbolName_38: PIN_GATE_IO; SymbolName_39: PIN_GATE_IO; SymbolName_40: PIN_GATE_IO; SymbolName_41: PIN_GATE_IO; SymbolName_42: PIN_GATE_IO; SymbolName_43: PIN_GATE_IO; SymbolName_44: PIN_GATE_IO; SymbolName_45: PIN_GATE_IO; SymbolName_46: PIN_GATE_IO; SymbolName_47: PIN_GATE_IO; SymbolName_48: PIN_GATE_IO; SymbolName_49: PIN_GATE_IO; SymbolName_50: PIN_GATE_IO; SymbolName_51: PIN_GATE_IO; SymbolName_52: PIN_GATE_IO; SymbolName_53: PIN_GATE_IO; SymbolName_54: PIN_GATE_IO; SymbolName_55: PIN_GATE_IO; SymbolName_56: PIN_GATE_IO; SymbolName_57: PIN_GATE_IO; SymbolName_58: PIN_GATE_IO; SymbolName_59: PIN_GATE_IO; SymbolName_60: PIN_GATE_IO; SymbolName_61: PIN_GATE_IO; SymbolName_62: PIN_GATE_IO; SymbolName_63: PIN_GATE_IO; SymbolName_64: PIN_GATE_IO; SymbolName_65: PIN_GATE_IO; SymbolName_66: PIN_GATE_IO; SymbolName_67: PIN_GATE_IO; SymbolName_68: PIN_GATE_IO; SymbolName_69: PIN_GATE_IO; SymbolName_70: PIN_GATE_IO; SymbolName_71: PIN_GATE_IO; SymbolName_72: PIN_GATE_IO; SymbolName_73: PIN_GATE_IO; SymbolName_74: PIN_GATE_IO; SymbolName_75: PIN_GATE_IO; SymbolName_76: PIN_GATE_IO; SymbolName_77: PIN_GATE_IO; SymbolName_78: PIN_GATE_IO; SymbolName_79: PIN_GATE_IO; SymbolName_81: PIN_GATE_IO; SymbolName_83: PIN_GATE_IN; SymbolName_84: PIN_GATE_IN; SymbolName_85: PIN_GATE_IN; SymbolName_86: PIN_GATE_IO; SymbolName_87: PIN_GATE_IO; SymbolName_88: PIN_GATE_IN; SymbolName_89: PIN_GATE_IN; SymbolName_90: PIN_GATE_IN; SymbolName_91: PIN_GATE_IN; SymbolName_92: PIN_GATE_IN; SymbolName_93: PIN_GATE_IN; SymbolName_94: PIN_GATE_IN; SymbolName_95: PIN_GATE_IN; SymbolName_96: PIN_GATE_IN; SymbolName_97: PIN_GATE_IN; SymbolName_98: PIN_GATE_IN; SymbolName_99: PIN_GATE_IN; SymbolName_100: PIN_GATE_IN; SymbolName_101: PIN_GATE_IN; SymbolName_102: PIN_GATE_IN; SymbolName_103: PIN_GATE_IN; SymbolName_104: PIN_GATE_IN; SymbolName_105: PIN_GATE_IN; SymbolName_106: PIN_GATE_IN; SymbolName_107: PIN_GATE_IN; SymbolName_108: PIN_GATE_IN; SymbolName_109: PIN_GATE_IN; SymbolName_110: PIN_GATE_IN; SymbolName_111: PIN_GATE_IN; SymbolName_112: PIN_GATE_IN; SymbolName_113: PIN_GATE_IN; SymbolName_114: PIN_GATE_IN; SymbolName_115: PIN_GATE_IN; SymbolName_116: PIN_GATE_IN; SymbolName_117: PIN_GATE_IN; SymbolName_118: PIN_GATE_IN; SymbolName_119: PIN_GATE_IN; SymbolName_120: PIN_GATE_IN; SymbolName_121: PIN_GATE_IN; SymbolName_122: PIN_GATE_IN; SymbolName_123: PIN_GATE_IN; SymbolName_124: PIN_GATE_IN; SymbolName_125: PIN_GATE_IN; SymbolName_126: PIN_GATE_IN; SymbolName_127: PIN_GATE_IN; SymbolName_128: PIN_GATE_IO; SymbolName_129: PIN_GATE_IN; SymbolName_130: PIN_GATE_IN; SymbolName_131: PIN_GATE_IN; SymbolName_132: PIN_GATE_IN; SymbolName_133: PIN_GATE_IN; SymbolName_134: PIN_GATE_IO; SymbolName_135: PIN_GATE_IN; SymbolName_136: PIN_GATE_IN; SymbolName_137: PIN_GATE_IO; SymbolName_138: PIN_GATE_IN; SymbolName_139: PIN_GATE_IO; SymbolName_140: PIN_GATE_IO; SymbolName_141: PIN_GATE_IN; SymbolName_142: PIN_GATE_IN; DeviceName: -1CPG236C; LibraryName: ctambe; DeviceSetName: XC7A35T-CPG236; POWER: POWER; MANF#: XC7A35T-1CPG236C

## Nets that join several sheets
GND: zulu_a7_1 (32 pins), zulu_a7_2 (12 pins), zulu_a7_3 (28 pins), zulu_a7_4 (28 pins), zulu_a7_6 (107 pins)
VCC1V0: zulu_a7_1 (C84.2 L3.2 U7.4), zulu_a7_2 (X2.20), zulu_a7_6 (20 pins)
VCC1V8: zulu_a7_1 (C82.2 L2.2 U6.4), zulu_a7_2 (X2.19), zulu_a7_6 (8 pins)
VCC3V3: zulu_a7_1 (C80.2 L1.2 LD5.A U5.4), zulu_a7_2 (8 pins), zulu_a7_3 (32 pins), zulu_a7_4 (31 pins), zulu_a7_6 (55 pins)
VU: zulu_a7_1 (15 pins), zulu_a7_2 (X2.22)
RST#: zulu_a7_2 (X2.23), zulu_a7_4 (R1.2 R4.16)
USB_D_N: zulu_a7_1 (X1.2), zulu_a7_4 (U2.7)
USB_D_P: zulu_a7_1 (X1.3), zulu_a7_4 (U2.8)